# Altium schematic sheet I2C_Keypad_host_module.SchDoc
size B; Author: AM; CompanyName: Expatria Technologies; DrawnBy: A.Marles; Engineer: AM; Organization: Expatria Technologies; DocumentNumber: 13; Revision: A1; SheetNumber: 13; SheetTotal: 14; PCB_Rev: A1
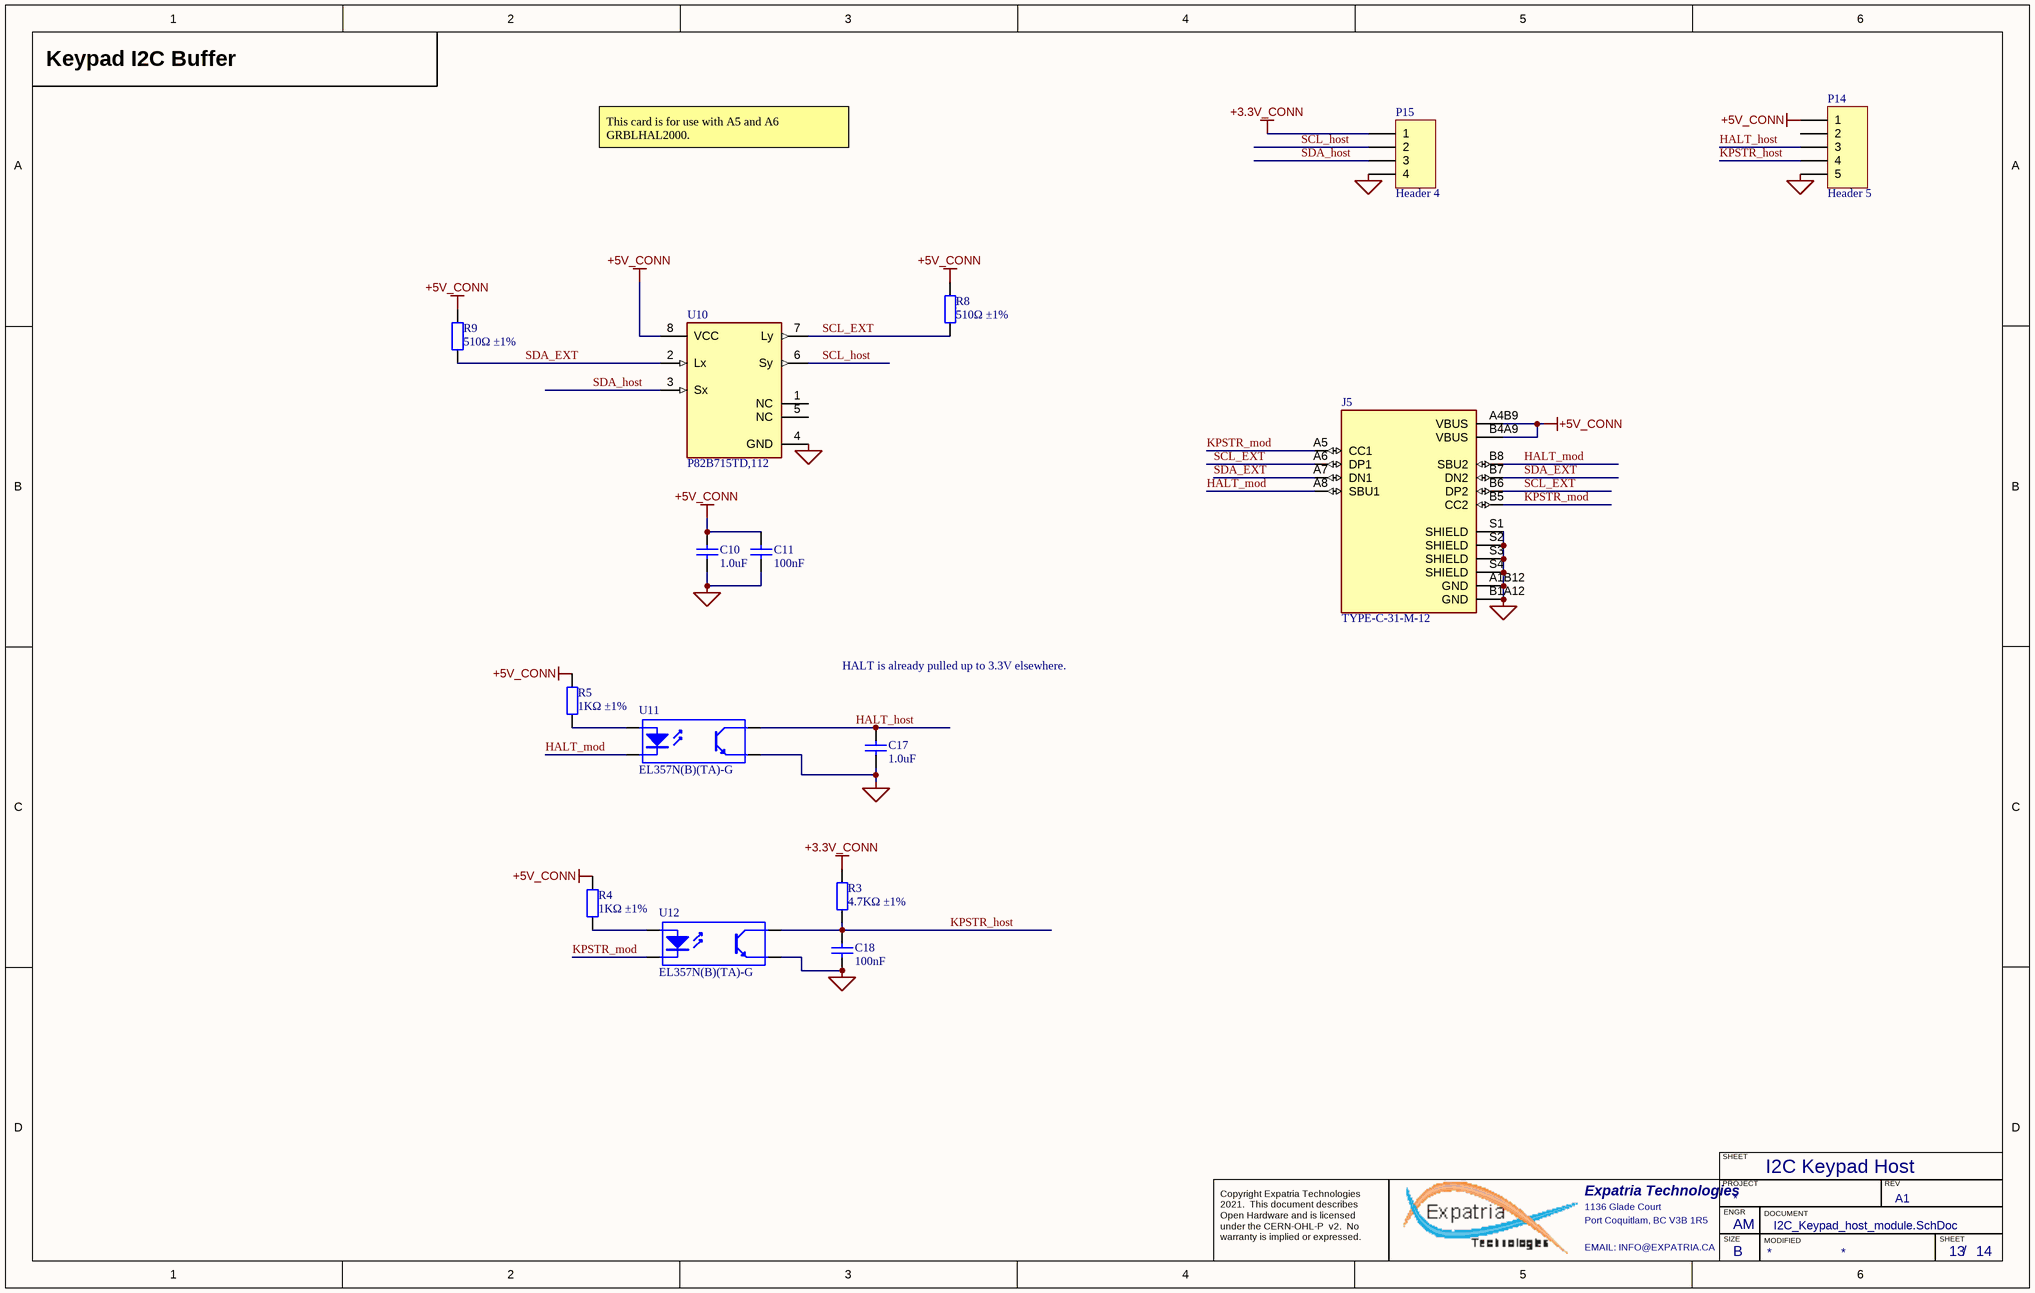
[diagram p0: I2C_Keypad_host_module.SchDoc]

## Parts
C10  1.0uF  [0402_C]
C11  100nF  [0402_C]
C17  1.0uF  [0402_C]
C18  100nF  [0402_C]
J5  TYPE-C-31-M-12  [HRO_TYPE-C-31-M-12]
P14  Header 5  [HDR1X5]  (no BOM)
P15  Header 4  [HDR1X4]  (no BOM)
R3  4.7KΩ ±1%  [0402_R]
R4  1KΩ ±1%  [0402_R]
R5  1KΩ ±1%  [0402_R]
R8  510Ω ±1%  [0402_R]
R9  510Ω ±1%  [0402_R]
U10  P82B715TD,112  [FP-SOT96-1-MFG]
U11  EL357N(B)(TA)-G  [SOP-4_P2.54]
U12  EL357N(B)(TA)-G  [SOP-4_P2.54]

## Nets
+3.3V_CONN: P15.1 R3.2
+5V_CONN: C10.2 C11.2 J5.A4B9(VBUS) J5.B4A9(VBUS) P14.1 R4.1 R5.1 R8.2 R9.2 U10.8(VCC)
GND_CONN: C10.1 C11.1 C17.1 C18.1 J5.A1B12(GND) J5.B1A12(GND) J5.S1(SHIELD) J5.S2(SHIELD) J5.S3(SHIELD) J5.S4(SHIELD) P14.5 P15.4 U10.4(GND) U11.3(E) U12.3(E)
HALT_host: C17.2 P14.3 U11.4(C)
HALT_mod: J5.A8(SBU1) J5.B8(SBU2) U11.2(K)
KPSTR_host: C18.2 P14.4 R3.1 U12.4(C)
KPSTR_mod: J5.A5(CC1) J5.B5(CC2) U12.2(K)
SCL_EXT: J5.A6(DP1) J5.B6(DP2) R8.1 U10.7(Ly)
SCL_host: P15.2 U10.6(Sy)
SDA_EXT: J5.A7(DN1) J5.B7(DN2) R9.1 U10.2(Lx)
SDA_host: P15.3 U10.3(Sx)
NetR4_2: R4.2 U12.1(A)
NetR5_2: R5.2 U11.1(A)

Not connected (* = marked no-connect by the designer): P14 2; U10 1(NC) 5(NC)

## Notes on the sheet
- Keypad I2C Buffer
- This card is for use with A5 and A6 GRBLHAL2000.
- HALT is already pulled up to 3.3V elsewhere.
- I2C Keypad Host
- SHEET
- Expatria Technologies
- 1136 Glade Court
- Port Coquitlam, BC V3B 1R5
- PROJECT
- SIZE
- ENGR
- MODIFIED
- DOCUMENT
- REV
- Copyright Expatria Technologies 2021.  This document describes Open Hardware and is licensed under the CERN-OHL-P  v2.  No warranty is implied or expressed.
- EMAIL: INFO@EXPATRIA.CA
- B
- /

## Library data of the parts
C10 C17 = 0402 1.0uF (105) 10% 25V: Chip capacitor; Manufacturer: Samsung Electro-Mechanics; PartNumber: CL05A105KA5NQNC; Capacitance: 1uF; Tolerance: 10%; Voltage: 25V; ComponentLink1Description: Supplier link; ComponentLink1URL: http://www.szlcsc.com/product/details_53938.html; Package: 0402; Supplier: LC; SuppliersPartNumber: C52923
C11 C18 = 0402 100nF (104) 10% 16V: Chip capacitors; Manufacturer: Samsung Electro-Mechanics; PartNumber: CL05B104KO5NNNC; Tolerance: 10%; Voltage: 16V; ComponentLink1Description: Supplier link; ComponentLink1URL: http://www.szlcsc.com/product/details_1877.html; Package: 0402; Supplier: LC; SuppliersPartNumber: C1525; Capacitance: 100nF
J5 = TYPE-C-31-M-12: USB Connectors 24 Receptacle 1 8.94*7.3mm RoHS; MF: HRO Electronics Co., Ltd.; Value: *; SnapEDA_Link: https://www.snapeda.com/parts/TYPE-C-31-M-12/HRO%20Electronics%20Co.,%20Ltd./view-part/3228496/?ref=snap; Package: Package; MP: TYPE-C-31-M-12; Price: None; Availability: Unavailable; SuppliersPartNumber: C2765186
P14 = Header 5: Header, 5-Pin; LatestRevisionDate: 17-Jul-2002; LatestRevisionNote: Re-released for DXP Platform.; Publisher: Altium Limited; SuppliersPartNumber: C124379
P15 = Header 4: Header, 4-Pin; Publisher: Altium Limited; SuppliersPartNumber: C124378
R3 = 0402 4.7K (4701) 1%: Chip resistor; Manufacturer: Uniroyal Elec; PartNumber: 0402WGF4701TCE; Power: 1/16W; ComponentLink1Description: Supplier link; ComponentLink1URL: http://www.szlcsc.com/product/details_26643.html; Package: 0402; Supplier: LC; SuppliersPartNumber: C25900; Resistance: 4.7KΩ; Tolerance: 1%
R4 R5 = 0402 1K (1001) 1%: Chip resistor; Manufacturer: Uniroyal Elec; PartNumber: 0402WGF1001TCE; Power: 1/16W; ComponentLink1Description: Supplier link; ComponentLink1URL: http://www.szlcsc.com/product/details_12256.html; Package: 0402; Supplier: LC; SuppliersPartNumber: C11702; Resistance: 1KΩ; Tolerance: 1%
R8 R9 = 0402 510R (5100) 1%: Chip resistor; Manufacturer: Uniroyal Elec; PartNumber: 0402WGF5100TCE; Power: 1/16W; ComponentLink1Description: Supplier link; ComponentLink1URL: http://www.szlcsc.com/product/details_25866.html; Package: 0402; Supplier: LC; SuppliersPartNumber: C25123; Resistance: 510Ω; Tolerance: 1%
U10 = CMP-10107-000005-1: IC REDRIVER I2C 1CH 400KHZ 8SO; Manufacturer: NXP Semicon; Manufacturer_Part_Number: P82B715TD,118; Package: SO-8; SuppliersPartNumber: C2649394
U11 U12 = EL357N(B)(TA)-G_[C6649]: 贴片光耦; ComponentLink1Description: 供应商链接; ComponentLink1URL: http://www.szlcsc.com/product/details_7114.html; Package: SOP-4_P2.54; Supplier: LC; SuppliersPartNumber: C6649